# EAGLE schematic servoventil (EAGLE 9.2.2)
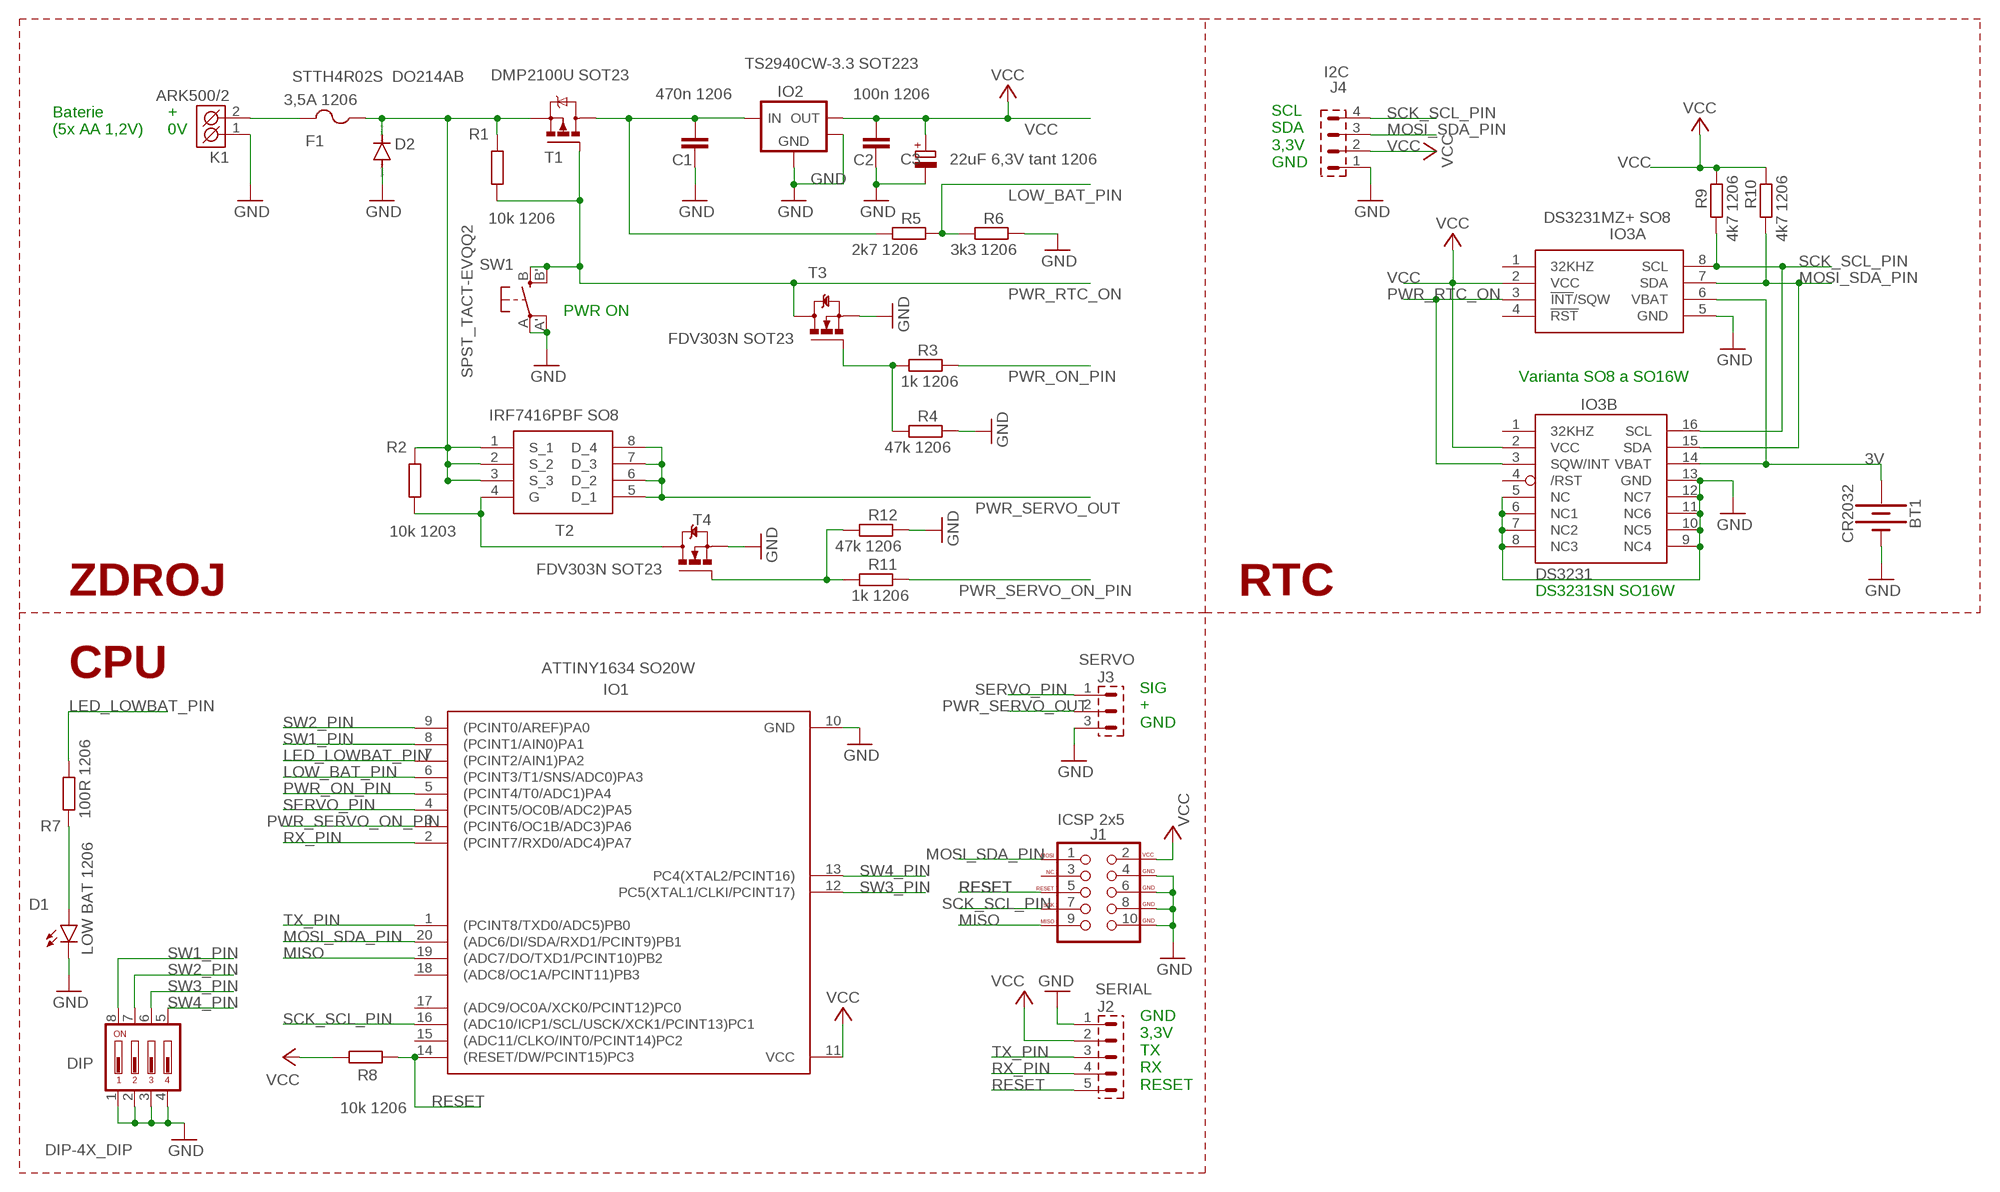
[diagram p0: schematic, sheet 1]

## Parts
BT1  CR2032  BATTERY-20MM_PTH  [BATTCOM_20MM_PTH]
C1  470n 1206  C-EUC1206  [C1206]
C2  100n 1206  C-EUC1206  [C1206]
C3  22uF 6,3V tant 1206  CPOL-EUCT3216  [CT3216]
D1  LOW BAT 1206  LED1206  [LED-1206]
D2  STTH4R02S DO214AB  DIODE-DO214AA  [DO214AA]
DIP  DIP-4X_DIP  [DIP-4X]
F1  3,5A 1206  PTCFUSE-1206  [R1206]
IO1  ATTINY1634 SO20W  ATTINY1634-SU  [SOIC20]
IO2  TS2940CW-3.3 SOT223  MCP1825_SOT223  [SOT-223-3]
IO3A  DS3231MZ+ SO8  DS3231MZ+  [SOIC127P600X175-8N]
IO3B  DS3231SN SO16W  DS3231/SO  [SO16W]
J1  ICSP 2x5  AVR_SPI_PROG_5X2LOCK  [2X5-SHROUDED_LOCK]
J2  SERIAL  S1G5_JUMP  [S1G5_JUM]
J3  SERVO  S1G3_JUMP  [S1G3_JUM]
J4  I2C  S1G4_JUMP  [S1G4_JUM]
K1  ARK500/2  [ARK500/2]
R1  10k 1206  R-EU_R1206  [R1206]
R2  10k 1203  R-EU_R1206  [R1206]
R3  1k 1206  R-EU_R1206  [R1206]
R4  47k 1206  R-EU_R1206  [R1206]
R5  2k7 1206  R-EU_R1206  [R1206]
R6  3k3 1206  R-EU_R1206  [R1206]
R7  100R 1206  R-EU_R1206  [R1206]
R8  10k 1206  R-EU_R1206  [R1206]
R9  4k7 1206  R-EU_R1206  [R1206]
R10  4k7 1206  R-EU_R1206  [R1206]
R11  1k 1206  R-EU_R1206  [R1206]
R12  47k 1206  R-EU_R1206  [R1206]
SW1  SPST_TACT-EVQQ2  [EVQ-Q2]
T1  DMP2100U SOT23  MOSFET-P-SOT23  [SOT-23]
T2  IRF7416PBF SO8  IRF7416PBF  [SOIC127P600X175-8N]
T3  FDV303N SOT23  MOSFET-N-SOT23  [SOT-23]
T4  FDV303N SOT23  MOSFET-N-SOT23  [SOT-23]

## Nets
3V: BT1.1(+) IO3A.6(VBAT) IO3B.14(VBAT)
6V: C1.1 IO2.1(VIN) R5.2 T1.3(D)
GND: BT1.2(-) C1.2 C2.2 C3.- D1.C D2.A DIP.1 DIP.2 DIP.3 DIP.4 IO1.10(GND) IO2.2(GND) IO2.4(HEATSINK) IO3A.5(GND) IO3B.5(NC) IO3B.6(NC1) IO3B.7(NC2) IO3B.8(NC3) IO3B.9(NC4) IO3B.10(NC5) IO3B.11(NC6) IO3B.12(NC7) IO3B.13(GND) J1.4(GND) J1.6(GND) J1.8(GND) J1.10(GND) J2.1 J3.3 J4.1 K1.1(K1) R4.1 R6.1 R12.1 SW1.A'(P1) SW1.A(P) T3.2(S) T4.2(S)
LED_LOWBAT_PIN: IO1.7((PCINT2/AIN1)PA2) R7.1
LOW_BAT_PIN: IO1.6((PCINT3/T1/SNS/ADC0)PA3) R5.1 R6.2
MISO: IO1.19((ADC7/DO/TXD1/PCINT10)PB2) J1.9(MISO)
MOSI_SDA_PIN: IO1.20((ADC6/DI/SDA/RXD1/PCINT9)PB1) IO3A.7(SDA) IO3B.15(SDA) J1.1(MOSI) J4.3 R10.2
N$1: F1.2 K1.2(K2)
N$2: D2.C F1.1 R1.2 R2.2 T1.2(S) T2.1(S_1) T2.2(S_2) T2.3(S_3)
N$3: R3.2 R4.2 T3.1(G)
N$4: R2.1 T2.4(G) T4.3(D)
N$5: R11.2 R12.2 T4.1(G)
N$12: D1.A R7.2
PWR_ON_PIN: IO1.5((PCINT4/T0/ADC1)PA4) R3.1
PWR_RTC_ON: IO3A.3(!INT!/SQW) IO3B.3(SQW/INT) R1.1 SW1.B'(S1) SW1.B(S) T1.1(G) T3.3(D)
PWR_SERVO_ON_PIN: IO1.3((PCINT6/OC1B/ADC3)PA6) R11.1
PWR_SERVO_OUT: J3.2 T2.5(D_1) T2.6(D_2) T2.7(D_3) T2.8(D_4)
RESET: IO1.14((RESET/DW/PCINT15)PC3) J1.5(RESET) J2.5 R8.2
RX_PIN: IO1.2((PCINT7/RXD0/ADC4)PA7) J2.4
SCK_SCL_PIN: IO1.16((ADC10/ICP1/SCL/USCK/XCK1/PCINT13)PC1) IO3A.8(SCL) IO3B.16(SCL) J1.7(SCK) J4.4 R9.2
SERVO_PIN: IO1.4((PCINT5/OC0B/ADC2)PA5) J3.1
SW1_PIN: DIP.8 IO1.8((PCINT1/AIN0)PA1)
SW2_PIN: DIP.7 IO1.9((PCINT0/AREF)PA0)
SW3_PIN: DIP.6 IO1.12(PC5(XTAL1/CLKI/PCINT17))
SW4_PIN: DIP.5 IO1.13(PC4(XTAL2/PCINT16))
TX_PIN: IO1.1((PCINT8/TXD0/ADC5)PB0) J2.3
VCC: C2.1 C3.+ IO1.11(VCC) IO2.3(VOUT) IO3A.2(VCC) IO3B.2(VCC) J1.2(VCC) J2.2 J4.2 R8.1 R9.1 R10.1
Unconnected: IO1.15((ADC11/CLKO/INT0/PCINT14)PC2) IO1.17((ADC9/OC0A/XCK0/PCINT12)PC0) IO1.18((ADC8/OC1A/PCINT11)PB3) IO3A.1(32KHZ) IO3A.4(!RST) IO3B.1(32KHZ) IO3B.4(/RST) J1.3(NC)

## Notes on the sheet
- Baterie 
  (5x AA 1,2V)
- +
  0V
- SCL
  SDA
  3,3V
  GND
- PWR ON
- Varianta SO8 a SO16W
- ZDROJ | RTC | DS3231SN SO16W
- CPU
- SIG
  +
  GND
- GND
  3,3V
  TX
  RX
  RESET

## Library data of the parts
BT1 = SparkFun-Batteries:BATTERY: Battery - Single Cell A variety of battery chemistries, sizes, and footprints. Device List: 20MM_PTH - Coin Cell Battery Holder - 20mm (PTH) <https://www.sparkfun.com/products/783> 20MM_PTH_KIT- Coin Cell battery Holder - 20 mm (PTH) <http://www.sparkfun.com/products/783>kit version with special mask 6.8MM_PTH - Coin Cell Battery Holder - 6.8MM(SMD) <https://www.digikey.com/product-detail/en/seiko-instruments/MS621FE-FL11E/728-1057-ND/1889208?WT.srch=1&gclid=CNOQ5a6LzdQCFZS2wAodXCkE0g> 12MM_SMD - Coin Cell Battery Holder - 12mm (SMD) <https://www.sparkfun.com/products/10592> 12MM_PTH - Coin Cell Battery Holder - 12mm (PTH) <https://www.sparkfun.com/products/7948> 20MM_SMD - 20mm Coin Cell Battery Holder (SMD) (2 legs) Used on the Big Time Watch Kit <https://www.sparkfun.com/products/11734> 20MM_SMD_4LEGS - Coin Cell Battery Holder - 20mm (SMD) <https://www.sparkfun.com/products/11892> 20MM_SMD_4LEGS_OVERPASTE - Coin Cell Battery Holder - 20mm (SMD) <https://www.sparkfun.com/products/11892> (Over-paste on the legs) 24.5MM_PTH - Coin Cell Battery Holder - 24.5mm (PTH) <https://www.sparkfun.com/products/8863> 9V - 9V Battery Holder - PC Mount Used on the SparkFun SparkPunk Sound Kit <https://www.sparkfun.com/products/11177> and SparkFun SparkPunk Sequencer Kit <https://www.sparkfun.com/products/12707> 18650 - Battery Holder - 18650 (PTH) <https://www.sparkfun.com/products/13113> AA - Battery Holder - 1xAA (PTH) <https://www.sparkfun.com/products/7949> AAA - Battery Holder - 1xAAA (PTH) <https://www.sparkfun.com/products/12718> AA_KIT - Battery Holder - 1xAA (PTH) <https://www.sparkfun.com/products/7949> Special kit package - pads only have exposed copper on one side of the board. AAA_KIT - Battery Holder - 1xAAA (PTH) <https://www.sparkfun.com/products/12718> Special kit package - pads only have exposed copper on one side of the board.; PROD_ID: BATT-09031; SF_SKU: PRT-00783
C1 C2 = rcl:C-EU: CAPACITOR, European symbol; SPICEPREFIX: C
C3 = rcl:CPOL-EU: POLARIZED CAPACITOR, European symbol; SPICEPREFIX: C
D1 = SparkFun-LED:LED: LED (Generic) Standard schematic elements and footprints for 5mm, 3mm, 1206, and 0603 sized LEDs. Generic LEDs with no color specified.
D2 = diode:DIODE-: DIODE
DIP = #PaJa_prepinace:DIP-4X: DIP Prepinac - 4x
F1 = adafruit:PTCFUSE: PTC fuses, resettable thermistors
IO1 = bt_avr:ATTINY1634: ATtiny1634 ATtiny1634 is a low-power CMOS 8-bit microcontrollers based on the AVR enhanced RISC architecture. By executing powerful instructions in a single clock cycle, the ATtiny1634 achieves throughputs approaching 1 MIPS per MHz allowing the system designer to optimize power consumption versus processing speed. datasheet_summary.pdf <http://www.atmel.com/Images/Atmel-8303-8-bit-AVR-Microcontroller-tinyAVR-ATtiny1634_Datasheet_summary.pdf>
IO2 = bt_regulator:MCP1825: Microchip MCP1824 LDO Voltage Regulator The MCP1825/MCP1825S is a 500 mA Low Dropout (LDO) linear regulator that provides high current and low output voltages. Datasheet.pdf <http://ww1.microchip.com/downloads/en/DeviceDoc/22056b.pdf>
IO3A = SamacSys_Parts:DS3231MZ+: Real Time Clock 5+/-ppm RTC Source: Datasheet <https://componentsearchengine.com/Datasheets/1/DS3231MZ .pdf>; DESCRIPTION: Real Time Clock 5+/-ppm RTC; HEIGHT: 1.75mm; MANUFACTURER_NAME: Maxim Integrated; MANUFACTURER_PART_NUMBER: DS3231MZ+; MOUSER_PART_NUMBER: 700-DS3231MZ+
IO3B = adafruit:DS3231
J1 = SparkFun-Connectors:AVR_SPI_PROG_5X2: AVR 10-pin ICSP Header This is the standard AVR In Circuit Serial Programming header. Minimal, but includes pin one indicator. Works with standard Olimex programmers. SparkFun Products: 2x5 AVR ICSP Male Header <https://www.sparkfun.com/products/778> - PTH 2x5 Pin Shrouded Header <https://www.sparkfun.com/products/8506> - PTH2; PROD_ID: CONN-08671; SF_ID: PRT-08506
J2 = #PaJa_konektory:S1G5_JUMP: Radove konektory - koliky - 5x
J3 = #PaJa_konektory:S1G3_JUMP: Radove konektory - koliky - 3x
J4 = #PaJa_konektory:S1G4_JUMP: Radove konektory - koliky - 4x
K1 = #PaJa_konektory:ARK500/2: Svorkovnice - roztec 5mm - dvojita
R1-R12 = rcl:R-EU_: RESISTOR, European symbol; SPICEPREFIX: R
SW1 = adafruit:SPST_TACT: SMT 6mm switch, EVQQ2 series http://www.ladyada.net/library/eagle
T1 = bt_transistor:MOSFET-P: P-Channel MOSFET with integrated body diode
T2 = SamacSys_Parts:IRF7416PBF: MOSFET P-Channel 30V 10A HEXFET SOIC8 Infineon IRF7416PBF P-channel MOSFET Transistor, 10 A, 30 V, 8-Pin SOIC Source: Datasheet <https://componentsearchengine.com/Datasheets/1/IRF7416PBF.pdf>; DESCRIPTION: MOSFET P-Channel 30V 10A HEXFET SOIC8 Infineon IRF7416PBF P-channel MOSFET Transistor, 10 A, 30 V, 8-Pin SOIC; HEIGHT: 1.75mm; MANUFACTURER_NAME: Infineon; MANUFACTURER_PART_NUMBER: IRF7416PBF; MOUSER_PART_NUMBER: 942-IRF7416PBF
T3 T4 = bt_transistor:MOSFET-N: N-Channel MOSFET